# Altium schematic sheet gydrodrive_currentSource.SchDoc
size 297 x 209 mm; SheetNumber: 8; SheetTotal: 22
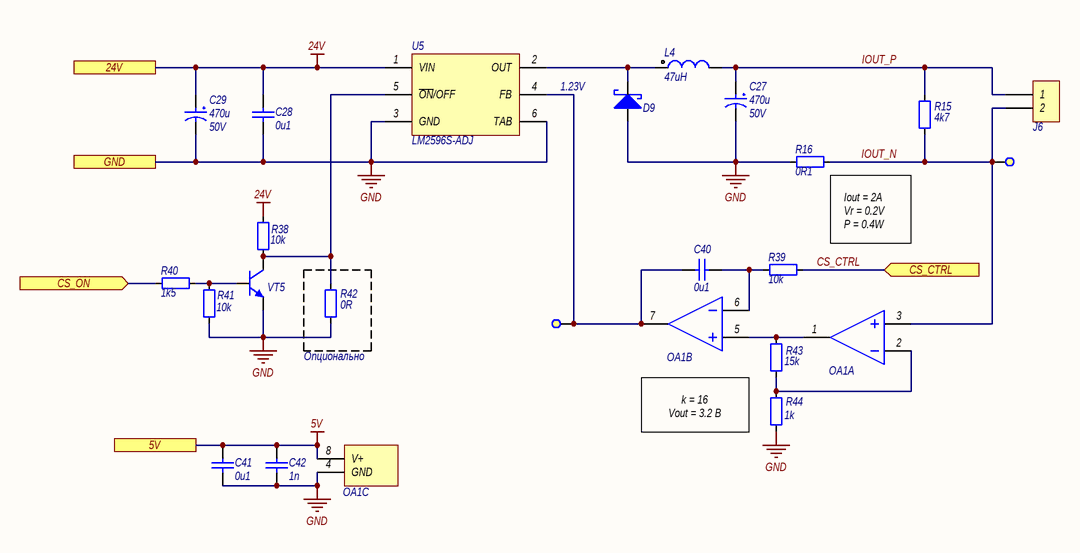
[diagram p0: gydrodrive_currentSource.SchDoc]

## Parts
C27  Capacitance: 470u  Voltage: 50V  [ECAP1020]  (hidden comment: JRB1H471M05001000200000B)
C28  Capacitance: 0u1  [CAPC2012-0805M]  (hidden comment: CAP_0805)
C29  Capacitance: 470u  Voltage: 50V  [ECAP1020]  (hidden comment: JRB1H471M05001000200000B)
C40  Capacitance: 0u1  [CAPC2012-0805M]  (hidden comment: CAP_0805)
C41  Capacitance: 0u1  [CAPC2012-0805M]  (hidden comment: CAP_0805)
C42  Capacitance: 1n  [CAPC2012-0805M]  (hidden comment: CAP_0805)
D9  SK56  [SMB_M]  (value not drawn)
J6  DG142V-5.08-02P  [DG142V-5.08-02P]  (value not drawn)
L4  Inductance: 47uH  [IND_IHL4040_M]  (hidden comment: IHLP4040DZER470M11)
OA1  LMV358IDR  [SO8_M]  (value not drawn)  (parts A,B,C of 3)
R15  Resistance: 4k7  [RESC3216-1206M]  (hidden comment: RES_1206)
R16  Resistance: 0R1  [RESC6332-2512M]  (hidden comment: RES_2512)
R38  Resistance: 10k  [RESC2012-0805M]  (hidden comment: RES_0805)
R39  Resistance: 10k  [RESC2012-0805M]  (hidden comment: RES_0805)
R40  Resistance: 1k5  [RESC2012-0805M]  (hidden comment: RES_0805)
R41  Resistance: 10k  [RESC2012-0805M]  (hidden comment: RES_0805)
R42  Resistance: 0R  [RESC2012-0805M]  (hidden comment: RES_0805)
R43  Resistance: 15k  [RESC2012-0805M]  (hidden comment: RES_0805)
R44  Resistance: 1k  [RESC2012-0805M]  (hidden comment: RES_0805)
TP6  Test point 1  [TP_1]  (value not drawn)  (no BOM)
TP7  Test point 1  [TP_1]  (value not drawn)  (no BOM)
U5  LM2596S-ADJ  [TO-263-5M]
VT5  BC817  [SOT23-3M]  (value not drawn)

## Ports
5V (see gydrodrive_main[1B], gydrodrive_can[4B], gydrodrive_discreteControl[3B], gydrodrive_interfaces[3C], gydrodrive_supply[5A]), 24V (see gydrodrive_main[1B], gydrodrive_button[4B], gydrodrive_control[4B], gydrodrive_discreteControl[4B], gydrodrive_encoder[5B], gydrodrive_linearPosSensor[3B], gydrodrive_sensor[3B], gydrodrive_sensors[2B], gydrodrive_sto[4B], gydrodrive_supply[2B]), CS_CTRL (in, see gydrodrive_main[2B], gydrodrive_mcu[3A]), CS_ON (in, see gydrodrive_main[2B], gydrodrive_mcu[3C]), GND (see gydrodrive_main[1B], gydrodrive_button[3C], gydrodrive_can[3C], gydrodrive_control[3B], gydrodrive_debugger[4C], gydrodrive_discreteControl[3B], gydrodrive_encoder[2A], gydrodrive_i2c[5C], gydrodrive_indication[4C], gydrodrive_inputTrim[4C], gydrodrive_interfaces[3A], gydrodrive_linearPosSensor[2C], gydrodrive_mcu[6D], gydrodrive_reservedPins[4B], gydrodrive_rs485[3B], gydrodrive_sensor[3C], gydrodrive_sensors[2B], gydrodrive_sto[3C], gydrodrive_supply[2C], gydrodrive_uart[4C])

## Nets
5V: C41.2 C42.2 OA1.8(V+) ; port 5V
24V: C28.1 C29.1 R38.2 U5.1(VIN) ; port 24V
GND: C27.2 C28.2 C29.2 C41.1 C42.1 D9.2(A) OA1.4(GND) R16.1 R41.1 R42.1 R44.1 U5.3(GND) U5.6(TAB) VT5.2(E) ; port GND
CS_CTRL: R39.1 ; port CS_CTRL
CS_ON: R40.2 ; port CS_ON
IOUT_N: J6.2 OA1.3(INA+) R15.1 R16.2 TP6.1
IOUT_P: C27.1 J6.1 L4.2 R15.2
NetC40_1: C40.1 OA1.6(INB-) R39.2
NetC40_2: C40.2 OA1.7(OUTB) TP7.1 U5.4(FB)
NetD9_1: D9.1(K) L4.1 U5.2(OUT)
NetOA1_1: OA1.1(OUTA) OA1.5(INB+) R43.2
NetOA1_2: OA1.2(INA-) R43.1 R44.2
NetR38_1: R38.1 R42.2 U5.5(~{ON}/OFF) VT5.3(C)
NetR40_1: R40.1 R41.2 VT5.1(B)

## Notes on the sheet
- 1.23V
- (near R16) Iout = 2A
  Vr = 0.2V
  P = 0.4W
- (near R42) Опционально
- k = 16
  Vout = 3.2 В
- Подп. и дата
- Инв. № дубл.
- Взам. инв. №
- Инв. № подл.
- Изм.
- Лист
- № докум.
- Подп.
- Дата
- Копировал
- Формат
- A4

## Library data of the parts
C27 C29 = JRB1H471M05001000200000B: Конденсатор электролитический; Part Name: Конд-р электрол.  JRB1H471M05001000200000B, 470uF, 50V; Parameters: 470uF, 50V; Max Price: 30; Part Number: JRB1H471M05001000200000B; Component Type: Standart
C28 C40 C41 = CAPC_0805: Конденсатор керамический, корпус 0805; Parameters: 0u1,  50V; Voltage: 50V; Max Price: 5; Part Number: CAPC_0805; Part Name: ='Конд-р керам. 0805,  '  + Parameters; Component Type: Standart; Pin Count: 2
C42 = CAPC_0805: Конденсатор керамический, корпус 0805; Parameters: 1n,  50V; Voltage: 50V; Max Price: 5; Part Number: CAPC_0805; Part Name: ='Конд-р керам. 0805,  '  + Parameters; Component Type: Standart; Pin Count: 2
D9 = SK56: Диод Шоттки; Part Name: Диод Шоттки SK56; Parameters: 60V, 5A; Voltage: 60V; Current: 5A; Max Price: 50; Part Number: SK56; Component Type: Standart; Pin Count: 2
J6 = DG142V-5.08-02P: Клеммник 2-контактный, шаг 5.08 мм; Part Name: Клеммник DG142V-5.08-02P; Parameters: 8А; Max Price: 60; System: Connector; Part Number: DG142V-5.08-02P; Component Type: Standart; Pin Count: 2
L4 = IHLP4040DZER470M11: Индуктивность силовая; Part Name: Индуктивность IHLP4040DZER470M11; Current: 3A; Max Price: 100; Part Number: IHLP4040DZER470M11; Component Type: Standart; Pin Count: 2; Parameters: 47uH
OA1 = LMV358IDR: Операционный усилитель RTR, маломощный, 2 канала; Part Name: Операционный усилитель LMV358IDR; Supply Current: 210uA; Supply Voltage: 2.7..5.5V; Max Price: 40; Offset Voltage: 1700uV; Bias Current: 15nA; RTR: IO; Part Number: LMV358IDR; Component Type: Standart; Pin Count: 8
R15 = RESC_1206: Рез-р, корпус 1206; Tolerance: 5%; Parameters: 4k7, 5%; Max Price: 12; Part Number: RESC_1206; Part Name: ='Рез-р 1206, ' + Parameters; Component Type: Standart
R16 = RESC_2512: Рез-р, корпус 2512; Tolerance: 5%; Parameters: 0R1, 5%; Max Price: 20; Part Number: RESC_2512; Part Name: ='Рез-р 2512, ' + Parameters; Component Type: Standart
R38 R39 R41 = RESC_0805: Рез-р, корпус 0805; Tolerance: 5%; Parameters: 10k, 5%; Max Price: 3; Part Number: RESC_0805; Part Name: ='Рез-р 0805, ' + Parameters; Component Type: Standart
R40 = RESC_0805: Рез-р, корпус 0805; Tolerance: 5%; Parameters: 1k5, 5%; Max Price: 3; Part Number: RESC_0805; Part Name: ='Рез-р 0805, ' + Parameters; Component Type: Standart
R42 = RESC_0805: Рез-р, корпус 0805; Tolerance: 5%; Parameters: 0R, 5%; Max Price: 3; Part Number: RESC_0805; Part Name: ='Рез-р 0805, ' + Parameters; Component Type: Standart
R43 = RESC_0805: Рез-р, корпус 0805; Tolerance: 5%; Parameters: 15k, 5%; Max Price: 3; Part Number: RESC_0805; Part Name: ='Рез-р 0805, ' + Parameters; Component Type: Standart
R44 = RESC_0805: Рез-р, корпус 0805; Tolerance: 5%; Parameters: 1k, 5%; Max Price: 3; Part Number: RESC_0805; Part Name: ='Рез-р 0805, ' + Parameters; Component Type: Standart
TP6 TP7 = Test point 1: Тестовый контакт круглый 1 мм; Part Number: Test point 1; Part Name: Тестовый контакт; Component Type: Standart (No BOM)
U5 = LM2596S-ADJ: DC-DC преобразователь; Part Name: DC-DC преобразователь LM2596S-ADJ; Parameters: 40V, 1.23..37V, 3A, 150kHz; Max Price: 600; ComponentLink1Description: LM2596 Datasheet; ComponentLink1URL: http://www.national.com/ds/LM/LM2596.pdf; ComponentLink3Description: TS5B Package Page; ComponentLink3URL: http://www.national.com/packaging/folders/ts5b.html; Part Number: LM2596S-ADJ; Component Type: Standart; HelpURL: https://www.ti.com/lit/ds/symlink/lm2596.pdf
VT5 = BC817: Биполярный транзистор; Part Name: Транзистор BC817; Parameters: 45V, 0.5A; Voltage: 45V; Current: 500 mA; Max Price: 20; Part Number: BC817; Component Type: Standart